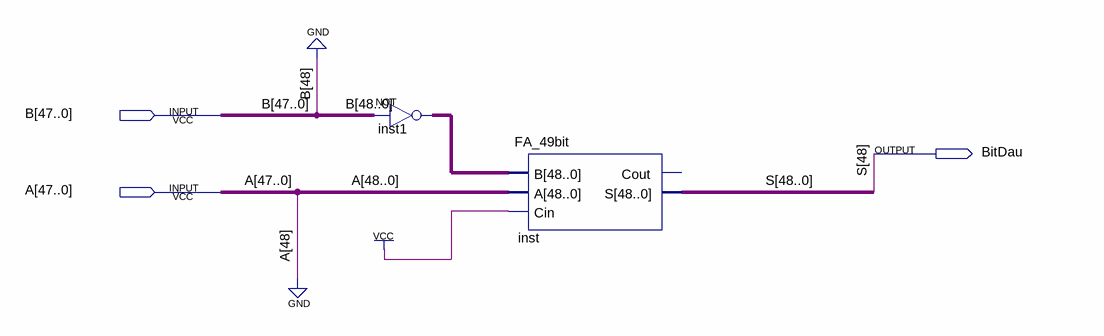
[diagram p0: schematic sheet]
// Quartus schematic BitDau.bdf as structural Verilog: 2 symbols, 3 pins
module BitDau (
  input  [47:0] B,
  input  [47:0] A,
  output BitDau
);

  wire [47:0] S;
  wire [48:0] inst1_out;

  assign inst1_out = ~{1'b0, B};  // NOT inst1, 49 bits wide
  FA_49bit inst (.B(inst1_out), .A({1'b0, A}), .Cin(1'b1), .S({BitDau, S}));  // open: Cout

  // Other names for the same wires on the sheet: S[48] = BitDau
endmodule
